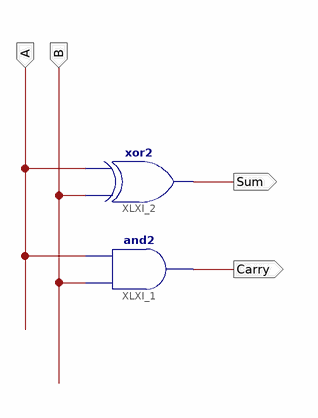
[diagram p0: schematic sheet 1]
// Xilinx ISE schematic half_adder_schema.sch (spartan3a) as structural Verilog: 2 symbols, 4 ports
module half_adder_schema (
  input  A,
  input  B,
  output Sum,
  output Carry
);

  and XLXI_1 (Carry, B, A);
  xor XLXI_2 (Sum, B, A);
endmodule
